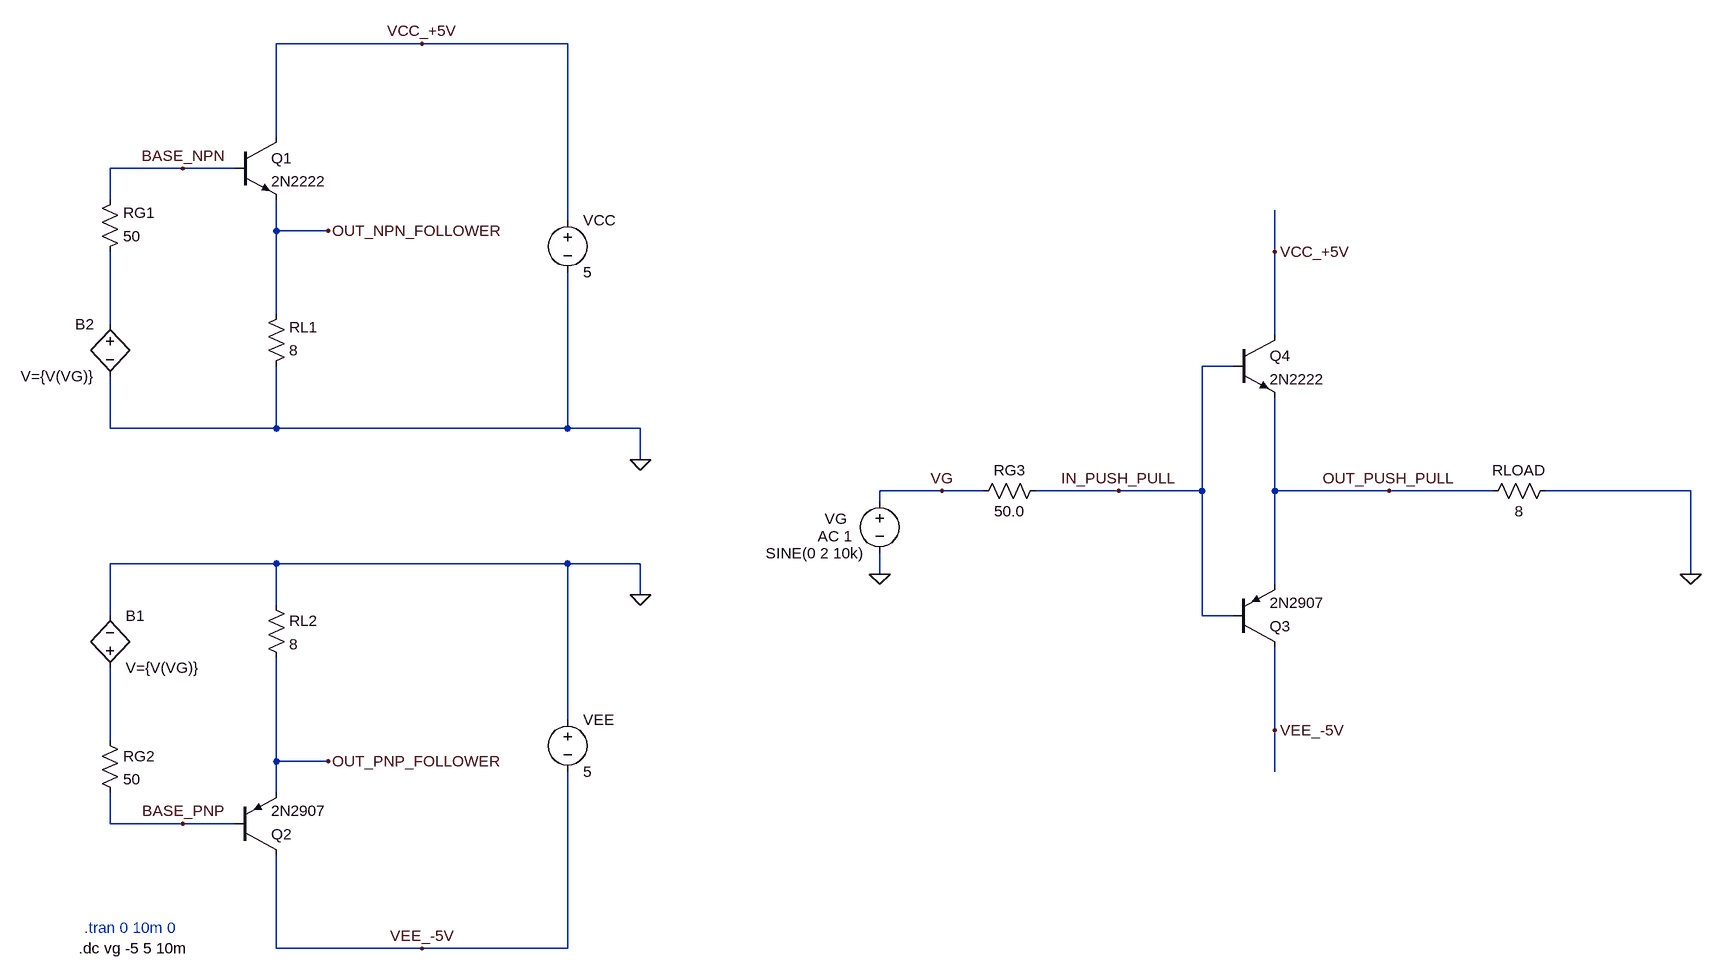
[diagram p0: schematic Emitter_Follower_and_Push_Pull_DC_Sweep_Sims.asc]
Emitter_Follower_and_Push_Pull_DC_Sweep_Sims.asc, the LTspice schematic file:
Version 4.1
SHEET 1 2452 1136
WIRE 480 -800 256 -800
WIRE 704 -800 480 -800
WIRE 256 -656 256 -800
WIRE 112 -608 0 -608
WIRE 192 -608 112 -608
WIRE 0 -560 0 -608
WIRE 704 -528 704 -800
WIRE 256 -512 256 -560
WIRE 336 -512 256 -512
WIRE 1792 -480 1792 -544
WIRE 256 -384 256 -512
WIRE 0 -368 0 -480
WIRE 1792 -352 1792 -480
WIRE 1728 -304 1680 -304
WIRE 0 -208 0 -288
WIRE 256 -208 256 -304
WIRE 256 -208 0 -208
WIRE 704 -208 704 -448
WIRE 704 -208 256 -208
WIRE 816 -208 704 -208
WIRE 816 -160 816 -208
WIRE 1280 -112 1184 -112
WIRE 1344 -112 1280 -112
WIRE 1552 -112 1424 -112
WIRE 1680 -112 1680 -304
WIRE 1680 -112 1552 -112
WIRE 1792 -112 1792 -256
WIRE 1968 -112 1792 -112
WIRE 2128 -112 1968 -112
WIRE 2432 -112 2208 -112
WIRE 1184 -96 1184 -112
WIRE 256 0 0 0
WIRE 704 0 256 0
WIRE 816 0 704 0
WIRE 1184 16 1184 -16
WIRE 2432 16 2432 -112
WIRE 1792 32 1792 -112
WIRE 816 48 816 0
WIRE 256 64 256 0
WIRE 0 80 0 0
WIRE 1680 80 1680 -112
WIRE 1728 80 1680 80
WIRE 704 240 704 0
WIRE 1792 256 1792 128
WIRE 0 272 0 160
WIRE 256 304 256 144
WIRE 336 304 256 304
WIRE 1792 320 1792 256
WIRE 256 352 256 304
WIRE 0 400 0 352
WIRE 112 400 0 400
WIRE 192 400 112 400
WIRE 256 592 256 448
WIRE 480 592 256 592
WIRE 704 592 704 320
WIRE 704 592 480 592
FLAG 816 48 0
FLAG 480 592 VEE_-5V
FLAG 112 400 BASE_PNP
FLAG 336 304 OUT_PNP_FOLLOWER
FLAG 816 -160 0
FLAG 480 -800 VCC_+5V
FLAG 112 -608 BASE_NPN
FLAG 336 -512 OUT_NPN_FOLLOWER
FLAG 1280 -112 VG
FLAG 1792 256 VEE_-5V
FLAG 1792 -480 VCC_+5V
FLAG 2432 16 0
FLAG 1968 -112 OUT_PUSH_PULL
FLAG 1552 -112 IN_PUSH_PULL
FLAG 1184 16 0
SYMBOL voltage 704 224 R0
WINDOW 123 0 0 Left 0
WINDOW 39 0 0 Left 0
SYMATTR InstName VEE
SYMATTR Value 5
SYMBOL pnp 192 448 M180
SYMATTR InstName Q2
SYMATTR Value 2N2907
SYMBOL res 240 48 R0
SYMATTR InstName RL2
SYMATTR Value 8
SYMBOL res -16 256 R0
SYMATTR InstName RG2
SYMATTR Value 50
SYMBOL voltage 704 -544 R0
WINDOW 123 0 0 Left 0
WINDOW 39 0 0 Left 0
SYMATTR InstName VCC
SYMATTR Value 5
SYMBOL res 240 -288 M180
WINDOW 0 36 76 Left 2
WINDOW 3 36 40 Left 2
SYMATTR InstName RL1
SYMATTR Value 8
SYMBOL voltage 1184 -112 M0
WINDOW 123 42 70 Left 2
WINDOW 39 0 0 Left 0
WINDOW 0 50 43 Left 2
SYMATTR Value2 AC 1
SYMATTR InstName VG
SYMATTR Value SINE(0 2 10k)
SYMBOL res -16 -464 M180
WINDOW 0 36 76 Left 2
WINDOW 3 36 40 Left 2
SYMATTR InstName RG1
SYMATTR Value 50
SYMBOL npn 192 -656 R0
SYMATTR InstName Q1
SYMATTR Value 2N2222
SYMBOL bv 0 176 M180
WINDOW 0 24 96 Left 2
WINDOW 3 24 16 Left 2
SYMATTR InstName B1
SYMATTR Value V={V(VG)}
SYMBOL pnp 1728 128 M180
SYMATTR InstName Q3
SYMATTR Value 2N2907
SYMBOL npn 1728 -352 R0
SYMATTR InstName Q4
SYMATTR Value 2N2222
SYMBOL res 2112 -96 R270
WINDOW 0 32 56 VTop 2
WINDOW 3 0 56 VBottom 2
SYMATTR InstName RLOAD
SYMATTR Value 8
SYMBOL bv 0 -384 M0
SYMATTR InstName B2
SYMATTR Value V={V(VG)}
SYMBOL res 1328 -96 R270
WINDOW 0 32 56 VTop 2
WINDOW 3 0 56 VBottom 2
SYMATTR InstName RG3
SYMATTR Value 50.0
TEXT -40 560 Left 2 ;.tran 0 10m 0
TEXT -48 592 Left 2 !.dc vg -5 5 10m

The netlist it stands for:
* Emitter_Follower_and_Push_Pull_DC_Sweep_Sims.asc
VEE 0 VEE_-5V 5
Q2 VEE_-5V BASE_PNP OUT_PNP_FOLLOWER 0 2N2907
RL2 0 OUT_PNP_FOLLOWER 8
RG2 N002 BASE_PNP 50
VCC VCC_+5V 0 5
RL1 0 OUT_NPN_FOLLOWER 8
VG VG 0 SINE(0 2 10k) AC 1
RG1 N001 BASE_NPN 50
Q1 VCC_+5V BASE_NPN OUT_NPN_FOLLOWER 0 2N2222
B1 N002 0 V={V(VG)}
Q3 VEE_-5V IN_PUSH_PULL OUT_PUSH_PULL 0 2N2907
Q4 VCC_+5V IN_PUSH_PULL OUT_PUSH_PULL 0 2N2222
RLOAD OUT_PUSH_PULL 0 8
B2 N001 0 V={V(VG)}
RG3 VG IN_PUSH_PULL 50.0
.model NPN NPN
.model PNP PNP
.lib standard.bjt
* .tran 0 10m 0
.dc vg -5 5 10m
.backanno
.end